# Altium schematic sheet 定位手表.SchDoc
size A4
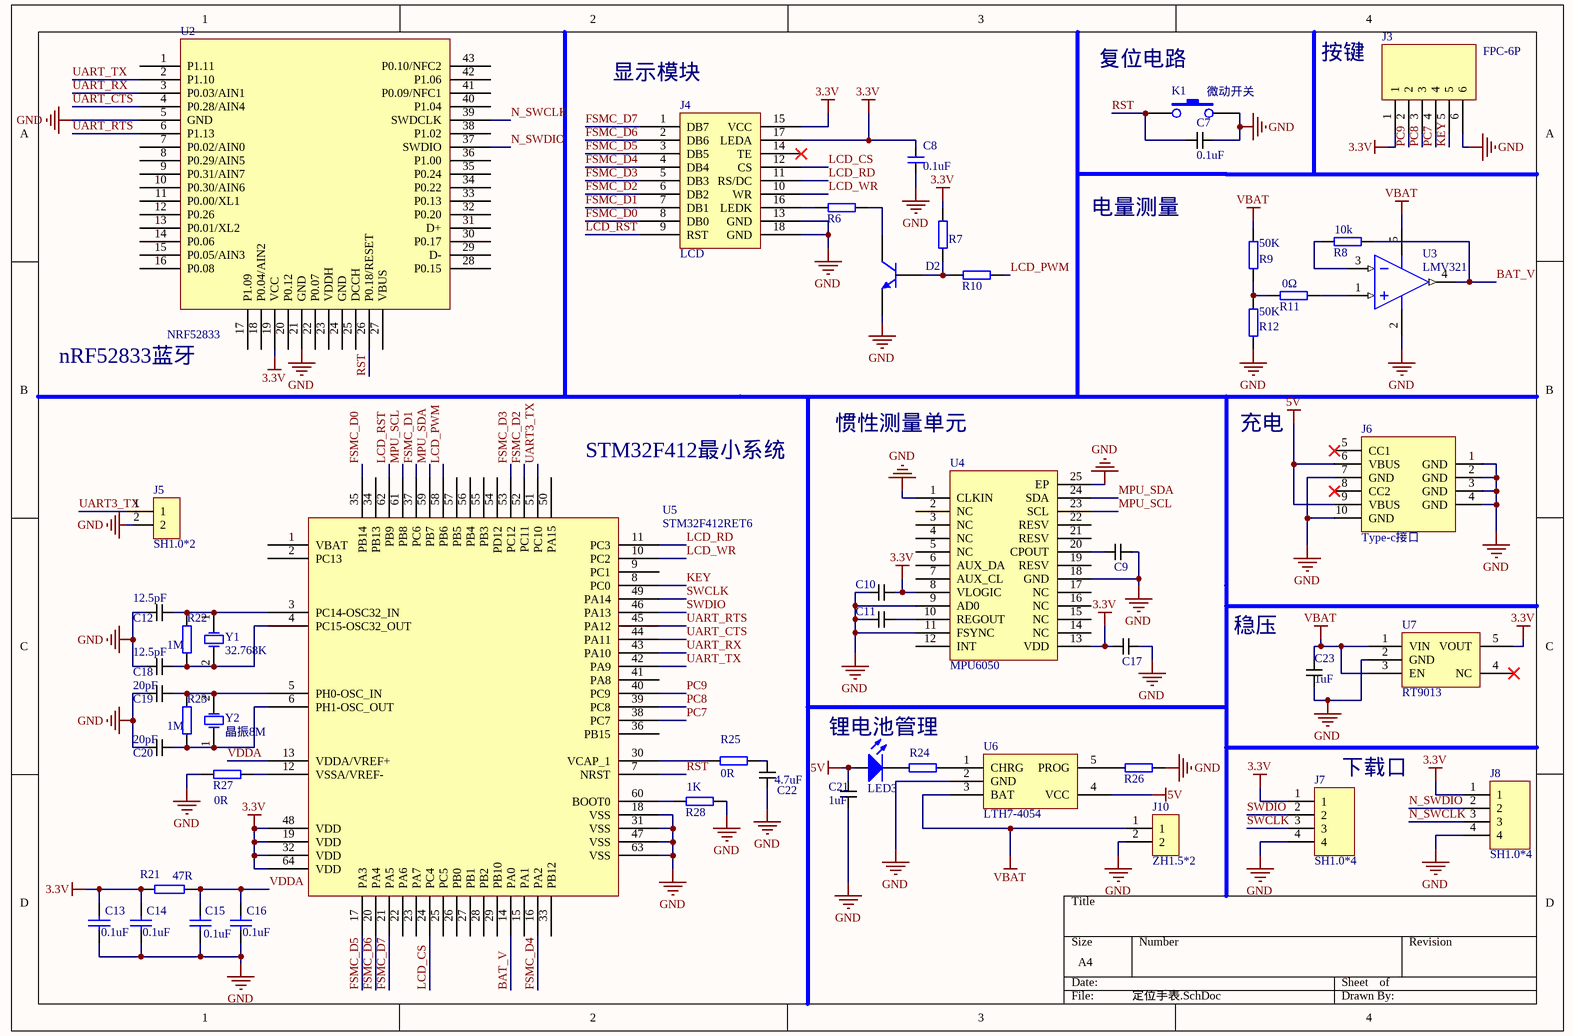
[diagram p0: 定位手表.SchDoc]

## Parts
C7  0.1uF  [0402-CAP]
C8  0.1uF  [0402-CAP]
C9  2.2nF  [0402-CAP]  (value not drawn)
C10  0.1uF  [0402-CAP]  (value not drawn)
C11  0.1uF  [0402-CAP]  (value not drawn)
C12  12.5pF  [0402-CAP]
C13  0.1uF  [0402-CAP]
C14  0.1uF  [0402-CAP]
C15  0.1uF  [0402-CAP]
C16  0.1uF  [0402-CAP]
C17  0.1uF  [0402-CAP]  (value not drawn)
C18  12.5pF  [0402-CAP]
C19  20pF  [0402-CAP]
C20  20pF  [0402-CAP]
C21  1uF  [0402-CAP]
C22  4.7uF  [0603-CAP]
C23  1uF  [0402-CAP]
D2  三极管  [SOT23-3M]  (value not drawn)
J3  FPC-6P  [FPC0.5-WT-6P]
J4  LCD  [LCD]
J5  SH1.0*2  [SH1.0-WT-2P]
J6  Type-c接口  [type-c]
J7  SH1.0*4  [SH1.0-WT-4P]
J8  SH1.0*4  [SH1.0-WT-4P]
J10  ZH1.5*2  [ZH1.5-WS-2P]
K1  微动开关  [轻触开关]
LED3  发光二极管  [0603-LED]  (value not drawn)
R6  10R  [0402-RES]  (value not drawn)
R7  10K  [0402-RES]  (value not drawn)
R8  10k  [0402-RES]
R9  50K  [0402-RES]
R10  1K  [0402-RES]  (value not drawn)
R11  0Ω  [0402-RES]
R12  50K  [0402-RES]
R21  47R  [0402-RES]
R22  1M  [0402-RES]
R23  1M  [0402-RES]
R24  10K  [0402-RES]  (value not drawn)
R25  0R  [0402-RES]
R26  1.65K  [0402-RES]  (value not drawn)
R27  0R  [0402-RES]
R28  1K  [0402-RES]
U2  NRF52833  [nrf52833]
U3  LMV321  [SOT23-5]
U4  MPU6050  [MPU6050]
U5  STM32F412RET6  [STM32F412RET6]
U6  LTH7-4054  [SOT23-5]
U7  RT9013  [SOT23-5]
Y1  32.768K  [晶振32.768K]
Y2  晶振8M  [晶振8M]

## Nets
3.3V: C8.1 C10.2 C13.2 C14.2 C17.2 J3.1 J4.15(VCC) J4.17(LEDA) J7.1 J8.1 R7.2 R21.1 U2.19(VCC) U4.8(VLOGIC) U4.13(VDD) U5.19(VDD) U5.32(VDD) U5.48(VDD) U5.64(VDD) U7.5(VOUT)
5V: C21.1 J6.6(VBUS) J6.9(VBUS) LED3.1 U6.4(VCC)
GND: C7.1 C8.2 C9.2 C10.1 C11.1 C12.1 C13.1 C14.1 C15.1 C16.1 C17.1 C18.1 C19.1 C20.1 C21.2 C22.1 C23.2 D2.2(E) J3.6 J4.13(GND) J4.18(GND) J5.2 J6.1(GND) J6.2(GND) J6.3(GND) J6.4(GND) J6.7(GND) J6.10(GND) J7.4 J8.4 J10.2 K1.2 R12.2 R26.2 R27.1 R28.2 U2.5(GND) U2.21(GND) U3.2 U4.1(CLKIN) U4.9(AD0) U4.11(FSYNC) U4.18(GND) U4.25(EP) U5.18(VSS) U5.31(VSS) U5.47(VSS) U5.63(VSS) U6.2(GND) U7.2(GND)
VBAT: C23.1 J10.1 R9.1 U3.5 U6.3(BAT) U7.1(VIN) U7.3(EN)
BAT_V: R8.2 U3.4 U5.14(PA0)
FSMC_D0: J4.8(DB0) U5.35(PB14)
FSMC_D1: J4.7(DB1) U5.37(PC6)
FSMC_D2: J4.6(DB2) U5.52(PC11)
FSMC_D3: J4.5(DB3) U5.53(PC12)
FSMC_D4: J4.4(DB4) U5.16(PA2)
FSMC_D5: J4.3(DB5) U5.17(PA3)
FSMC_D6: J4.2(DB6) U5.20(PA4)
FSMC_D7: J4.1(DB7) U5.21(PA5)
KEY: J3.5 U5.8(PC0)
LCD_CS: J4.12(CS) U5.24(PC4)
LCD_PWM: R10.2 U5.58(PB6)
LCD_RD: J4.11(RS/DC) U5.11(PC3)
LCD_RST: J4.9(RST) U5.62(PB9)
LCD_WR: J4.10(WR) U5.10(PC2)
MPU_SCL: U4.23(SCL) U5.61(PB8)
MPU_SDA: U4.24(SDA) U5.59(PB7)
N_SWCLK: J8.3 U2.39(SWDCLK)
N_SWDIO: J8.2 U2.37(SWDIO)
PC7: J3.4 U5.38(PC7)
PC8: J3.3 U5.39(PC8)
PC9: J3.2 U5.40(PC9)
RST: C7.2 K1.1 U2.26(P0.18/RESET) U5.7(NRST)
SWCLK: J7.3 U5.49(PA14)
SWDIO: J7.2 U5.46(PA13)
UART3_TX: J5.1 U5.51(PC10)
UART_CTS: U2.4(P0.28/AIN4) U5.44(PA11)
UART_RTS: U2.6(P1.13) U5.45(PA12)
UART_RX: U2.3(P0.03/AIN1) U5.43(PA10)
UART_TX: U2.2(P1.10) U5.42(PA9)
VDDA: C15.2 C16.2 R21.2 U5.13(VDDA/VREF+)
NetC9_1: C9.1 U4.20(CPOUT)
NetC11_2: C11.2 U4.10(REGOUT)
NetC12_2: C12.2 R22.1 U5.3(PC14-OSC32_IN) Y1.1(OSC1)
NetC18_2: C18.2 R22.2 U5.4(PC15-OSC32_OUT) Y1.2(OSC2)
NetC19_2: C19.2 R23.1 U5.5(PH0-OSC_IN) Y2.2(OSC2)
NetC20_2: C20.2 R23.2 U5.6(PH1-OSC_OUT) Y2.1(OSC1)
NetC22_2: C22.2 R25.2
NetD2_1: D2.1(B) R7.1 R10.1
NetD2_3: D2.3(C) R6.2
NetJ4_16: J4.16(LEDK) R6.1
NetLED3_2: LED3.2 R24.1
NetR8_1: R8.1 U3.3
NetR9_2: R9.2 R11.1 R12.1
NetR11_2: R11.2 U3.1
NetR24_2: R24.2 U6.1(CHRG)
NetR25_1: R25.1 U5.30(VCAP_1)
NetR26_1: R26.1 U6.5(PROG)
NetR27_2: R27.2 U5.12(VSSA/VREF-)
NetR28_1: R28.1 U5.60(BOOT0)

Not connected (* = marked no-connect by the designer): J4 14(TE)*; J6 5(CC1)* 8(CC2)*; U2 1(P1.11) 7(P0.02/AIN0) 8(P0.29/AIN5) 9(P0.31/AIN7) 10(P0.30/AIN6) 11(P0.00/XL1) 12(P0.26) 13(P0.01/XL2) 14(P0.06) 15(P0.05/AIN3) 16(P0.08) 17(P1.09) 18(P0.04/AIN2) 20(P0.12) 22(P0.07) 23(VDDH) 24(GND) 25(DCCH) 27(VBUS) 28(P0.15) 29(D-) 30(P0.17) 31(D+) 32(P0.20) 33(P0.13) 34(P0.22) 35(P0.24) 36(P1.00) 38(P1.02) 40(P1.04) 41(P0.09/NFC1) 42(P1.06) 43(P0.10/NFC2); U4 2(NC) 3(NC) 4(NC) 5(NC) 6(AUX_DA) 7(AUX_CL) 12(INT) 14(NC) 15(NC) 16(NC) 17(NC) 19(RESV) 21(RESV) 22(RESV); U5 1(VBAT) 2(PC13) 9(PC1) 15(PA1) 22(PA6) 23(PA7) 25(PC5) 26(PB0) 27(PB1) 28(PB2) 29(PB10) 33(PB12) 34(PB13) 36(PB15) 41(PA8) 50(PA15) 54(PD12) 55(PB3) 56(PB4) 57(PB5); U7 4(NC)*

## Notes on the sheet
- (near J4) 显示模块
- (near K1) 复位电路
- 按键
- 电量测量
- (near U2) nRF52833蓝牙
- 惯性测量单元
- 充电
- STM32F412最小系统
- 稳压
- 锂电池管理
- (near J7) 下载口

## Library data of the parts
C7-C12 C17-C23 = 电容: 无极性贴片电容
C13-C16 = cap
J6 = Type-c接口: 接口
R6-R12 R22-R28 = 电阻
R21 = RES